# Altium schematic sheet Sheet_1.schdoc
size 424 x 281 mm
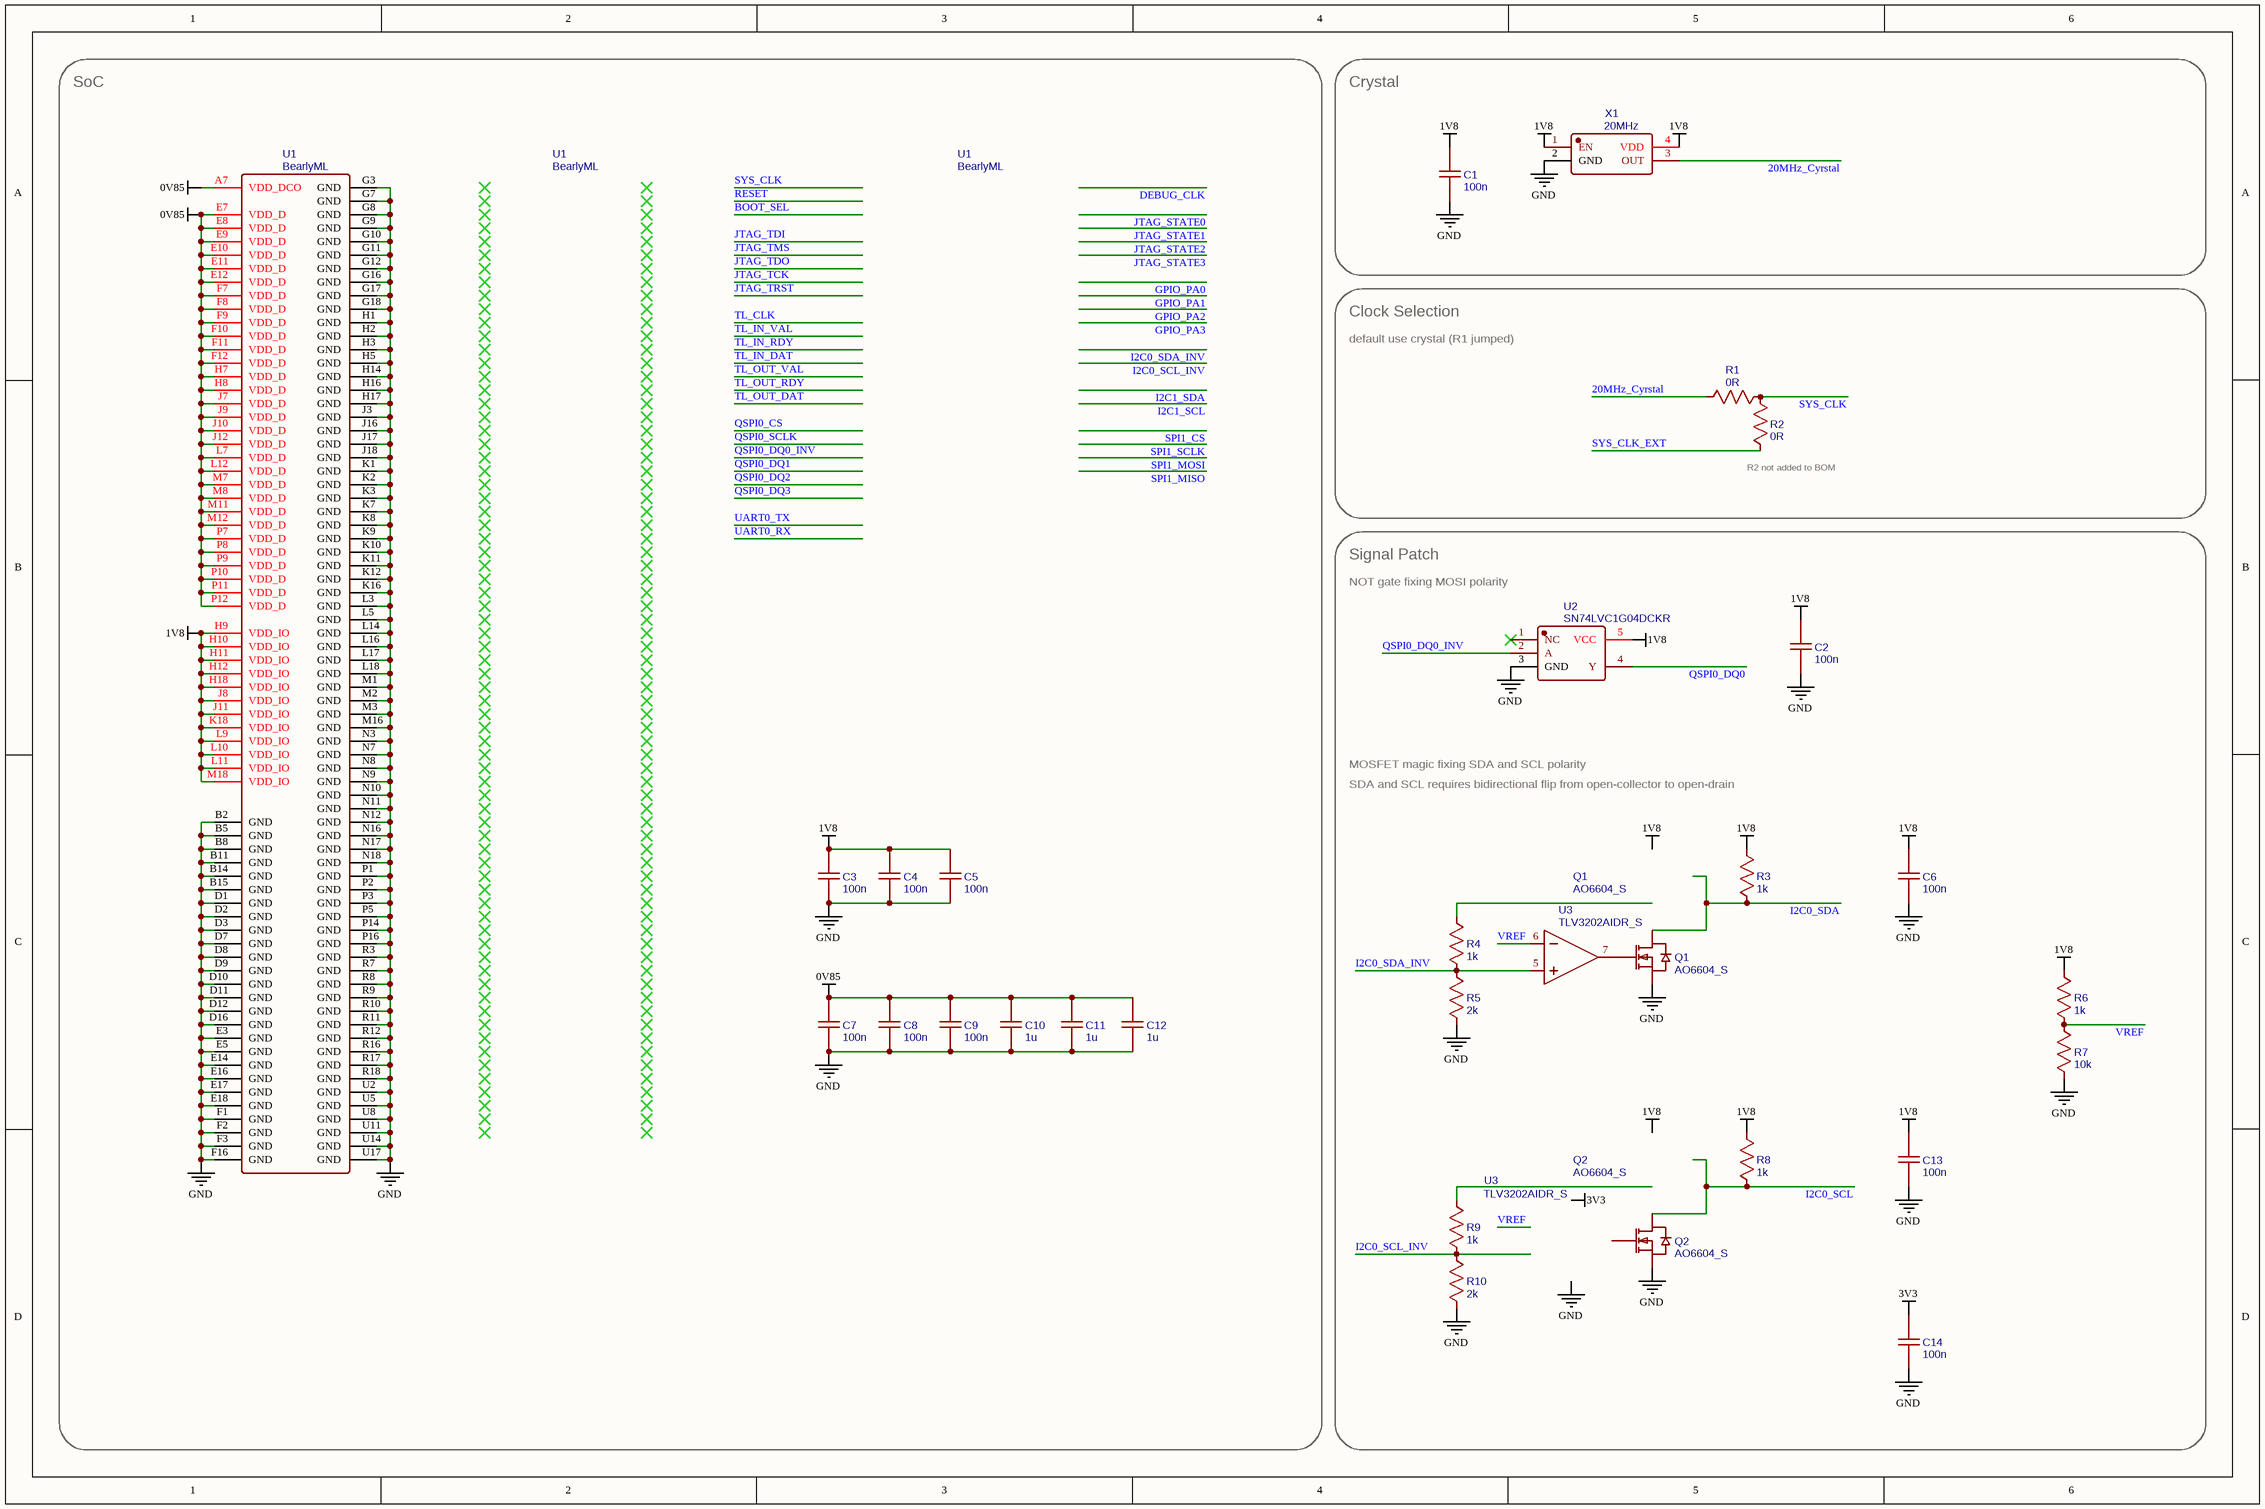
[diagram p0: Sheet_1.schdoc]

## Parts
(Parts that share a designator on the sheet are numbered #1, #2 ... from top to bottom, then left to right.)
C1  100n  [CAPA-0402]
C2  100n  [CAPA-0402]
C3  100n  [CAPA-0402]
C4  100n  [CAPA-0402]
C5  100n  [CAPA-0402]
C6  100n  [CAPA-0402]
C7  100n  [CAPA-0402]
C8  100n  [CAPA-0402]
C9  100n  [CAPA-0402]
C10  1u  [CAPA-0402]
C11  1u  [CAPA-0402]
C12  1u  [CAPA-0402]
C13  100n  [CAPA-0402]
C14  100n  [CAPA-0402]
Q1#1  AO6604_S  [TSOP-6_L3.0-W1.5-P0.95-LS2.8-BR]
Q1#2  AO6604_S  [TSOP-6_L3.0-W1.5-P0.95-LS2.8-BR]
Q2#1  AO6604_S  [TSOP-6_L3.0-W1.5-P0.95-LS2.8-BR]
Q2#2  AO6604_S  [TSOP-6_L3.0-W1.5-P0.95-LS2.8-BR]
R1  0R  [RES-0603]
R2  0R  [RES-0603]
R3  1k  [RES-0402]
R4  1k  [RES-0402]
R5  2k  [RES-0402]
R6  1k  [RES-0402]
R7  10k  [RES-0402]
R8  1k  [RES-0402]
R9  1k  [RES-0402]
R10  2k  [RES-0402]
U1#1  BearlyML  [FC-PBGA-1.0-324-R18-C18_INTEL]
U1#2  BearlyML  [FC-PBGA-1.0-324-R18-C18_INTEL]
U1#3  BearlyML  [FC-PBGA-1.0-324-R18-C18_INTEL]
U2  SN74LVC1G04DCKR  [SOT-353_L2.1-W1.3-P0.65-LS2.3-BR]
U3#1  TLV3202AIDR_S  [SOIC-8_L5.0-W4.0-P1.27-LS6.0-BL]
U3#2  TLV3202AIDR_S  [SOIC-8_L5.0-W4.0-P1.27-LS6.0-BL]
X1  20MHz  [OSC-SMD_4P-L2.5-W2.0-BL]

## Blocks framed on the sheet
SoC: C3-C5 C7-C12 U1#1-U1#3
Crystal: C1 X1
Clock Selection: R1 R2
Signal Patch: C2 C6 C13 C14 Q1#1 Q1#2 Q2#1 Q2#2 R3-R10 U2 U3#1 U3#2

## Nets
0V85: C7.2 C8.2 C9.2 C10.2 C11.2 C12.2 U1#1.A7(VDD_DCO) U1#1.E7(VDD_D) U1#1.E8(VDD_D) U1#1.E9(VDD_D) U1#1.E10(VDD_D) U1#1.E11(VDD_D) U1#1.E12(VDD_D) U1#1.F7(VDD_D) U1#1.F8(VDD_D) U1#1.F9(VDD_D) U1#1.F10(VDD_D) U1#1.F11(VDD_D) U1#1.F12(VDD_D) U1#1.H7(VDD_D) U1#1.H8(VDD_D) U1#1.J7(VDD_D) U1#1.J9(VDD_D) U1#1.J10(VDD_D) U1#1.J12(VDD_D) U1#1.L7(VDD_D) U1#1.L12(VDD_D) U1#1.M7(VDD_D) U1#1.M8(VDD_D) U1#1.M11(VDD_D) U1#1.M12(VDD_D) U1#1.P7(VDD_D) U1#1.P8(VDD_D) U1#1.P9(VDD_D) U1#1.P10(VDD_D) U1#1.P11(VDD_D) U1#1.P12(VDD_D)
1V8: C1.2 C2.2 C3.2 C4.2 C5.2 C6.2 C13.2 R3.2 R6.2 R8.2 U1#1.H9(VDD_IO) U1#1.H10(VDD_IO) U1#1.H11(VDD_IO) U1#1.H12(VDD_IO) U1#1.H18(VDD_IO) U1#1.J8(VDD_IO) U1#1.J11(VDD_IO) U1#1.K18(VDD_IO) U1#1.L9(VDD_IO) U1#1.L10(VDD_IO) U1#1.L11(VDD_IO) U1#1.M18(VDD_IO) U2.5(VCC) X1.1(EN) X1.4(VDD)
3V3: C14.2
GND: C1.1 C2.1 C3.1 C4.1 C5.1 C6.1 C7.1 C8.1 C9.1 C10.1 C11.1 C12.1 C13.1 C14.1 Q1#2.5(S1) Q2#2.5(S1) R5.1 R7.1 R10.1 U1#1.B2(GND) U1#1.B5(GND) U1#1.B8(GND) U1#1.B11(GND) U1#1.B14(GND) U1#1.B15(GND) U1#1.D1(GND) U1#1.D2(GND) U1#1.D3(GND) U1#1.D7(GND) U1#1.D8(GND) U1#1.D9(GND) U1#1.D10(GND) U1#1.D11(GND) U1#1.D12(GND) U1#1.D16(GND) U1#1.E3(GND) U1#1.E5(GND) U1#1.E14(GND) U1#1.E16(GND) U1#1.E17(GND) U1#1.E18(GND) U1#1.F1(GND) U1#1.F2(GND) U1#1.F3(GND) U1#1.F16(GND) U1#1.G3(GND) U1#1.G7(GND) U1#1.G8(GND) U1#1.G9(GND) U1#1.G10(GND) U1#1.G11(GND) U1#1.G12(GND) U1#1.G16(GND) U1#1.G17(GND) U1#1.G18(GND) U1#1.H1(GND) U1#1.H2(GND) U1#1.H3(GND) U1#1.H5(GND) U1#1.H14(GND) U1#1.H16(GND) U1#1.H17(GND) U1#1.J3(GND) U1#1.J16(GND) U1#1.J17(GND) U1#1.J18(GND) U1#1.K1(GND) U1#1.K2(GND) U1#1.K3(GND) U1#1.K7(GND) U1#1.K8(GND) U1#1.K9(GND) U1#1.K10(GND) U1#1.K11(GND) U1#1.K12(GND) U1#1.K16(GND) U1#1.L3(GND) U1#1.L5(GND) U1#1.L14(GND) U1#1.L16(GND) U1#1.L17(GND) U1#1.L18(GND) U1#1.M1(GND) U1#1.M2(GND) U1#1.M3(GND) U1#1.M16(GND) U1#1.N3(GND) U1#1.N7(GND) U1#1.N8(GND) U1#1.N9(GND) U1#1.N10(GND) U1#1.N11(GND) U1#1.N12(GND) U1#1.N16(GND) U1#1.N17(GND) U1#1.N18(GND) U1#1.P1(GND) U1#1.P2(GND) U1#1.P3(GND) U1#1.P5(GND) U1#1.P14(GND) U1#1.P16(GND) U1#1.R3(GND) U1#1.R7(GND) U1#1.R8(GND) U1#1.R9(GND) U1#1.R10(GND) U1#1.R11(GND) U1#1.R12(GND) U1#1.R16(GND) U1#1.R17(GND) U1#1.R18(GND) U1#1.U2(GND) U1#1.U5(GND) U1#1.U8(GND) U1#1.U11(GND) U1#1.U14(GND) U1#1.U17(GND) U2.3(GND) X1.2(GND)
20MHz_Cyrstal: R1.2 X1.3(OUT)
I2C0_SCL: Q2#2.6(D1) R8.1
I2C0_SCL_INV: R9.1 R10.2
I2C0_SDA: Q1#2.6(D1) R3.1
I2C0_SDA_INV: R4.1 R5.2 U3#1.5(+IN_B)
QSPI0_DQ0: U2.4(Y)
QSPI0_DQ0_INV: U2.2(A)
SYS_CLK: R1.1 R2.1
SYS_CLK_EXT: R2.2
VREF: R6.1 R7.2 U3#1.6(-IN_B)
NetQ1#2_1: Q1#2.1(G1) U3#1.7(OUT_B)

Not connected (* = marked no-connect by the designer): Q2#2 1(G1); R4 2; R9 2; U2 1(NC)*

## Notes on the sheet
- default use crystal (R1 jumped)
- (near R2) R2 not added to BOM
- NOT gate fixing MOSI polarity
- MOSFET magic fixing SDA and SCL polarity
- SDA and SCL requires bidirectional flip from open-collector to open-drain
- Labels drawn without touching a wire or pin: 1V8, 3V3, GND

## Library data of the parts
C1-C9 C13 C14 = 100n: BOM_Manufacturer Part: CL05B104KB54PNC; BOM_Manufacturer: SAMSUNG; nameAlias: Value(F); BOM_Supplier Part: C307331; BOM_Supplier: LCSC; link: https://atta.szlcsc.com//upload/public/pdf/source/20160103/1457707735223.pdf; spicePre: C; spiceSymbolName: CAPA-0402_100n
C10-C12 = 1u: BOM_Manufacturer Part: CL05A105KA5NQNC; BOM_Manufacturer: SAMSUNG; nameAlias: Value(F); BOM_Supplier Part: C52923; BOM_Supplier: LCSC; link: https://atta.szlcsc.com//upload/public/pdf/source/20160103/1457707735223.pdf; spicePre: C; spiceSymbolName: CAPA-0402_1u
Q1#1 Q2#1 = AO6604_S: BOM_Manufacturer: Alpha&Omega Semiconductor; BOM_Manufacturer Part: AO6604-VB; subpart_no: 2; BOM_Supplier: LCSC; BOM_Supplier Part: C709896; BOM_JLCPCB Part Class: Extended Part; link: http://www.aosmd.com/pdfs/datasheet/AO6604.pdf; spicePre: Q; spiceSymbolName: AO6604_S
Q1#2 Q2#2 = AO6604_S: BOM_Manufacturer: Alpha&Omega Semiconductor; BOM_Manufacturer Part: AO6604-VB; subpart_no: 1; BOM_Supplier: LCSC; BOM_Supplier Part: C709896; BOM_JLCPCB Part Class: Extended Part; link: http://www.aosmd.com/pdfs/datasheet/AO6604.pdf; spicePre: Q; spiceSymbolName: AO6604_S
R1 R2 = 0R: BOM_Manufacturer Part: 0603WAF0000T5E; BOM_Manufacturer: UniOhm 台湾厚声; nameAlias: Value(Ω); BOM_Supplier Part: C21189; BOM_Supplier: LCSC; link: https://atta.szlcsc.com/upload/public/pdf/source/20200306/C422600_1E6D84923E4A46A82E41ADD87F860B5C.pdf; spicePre: R; spiceSymbolName: RES-0603_0R
R3 R4 R6 R8 R9 = 1k: BOM_Manufacturer Part: 0402WGF1001TCE; BOM_Manufacturer: UniOhm 台湾厚声; nameAlias: Value(Ω); BOM_Supplier Part: C11702; BOM_Supplier: LCSC; link: https://atta.szlcsc.com//upload/public/pdf/source/20200306/C422600_1E6D84923E4A46A82E41ADD87F860B5C.pdf; spicePre: R; spiceSymbolName: RES-0402_1k
R5 R10 = 2k: BOM_Manufacturer Part: 0402WGF2001TCE; BOM_Manufacturer: UniOhm 台湾厚声; nameAlias: Value(Ω); BOM_Supplier Part: C4109; BOM_Supplier: LCSC; link: https://atta.szlcsc.com//upload/public/pdf/source/20200306/C422600_1E6D84923E4A46A82E41ADD87F860B5C.pdf; spicePre: R; spiceSymbolName: RES-0402_2k
R7 = 10k: BOM_Manufacturer Part: 0402WGF1002TCE; BOM_Manufacturer: UniOhm 台湾厚声; nameAlias: Value(Ω); BOM_Supplier Part: C25744; BOM_Supplier: LCSC; link: https://atta.szlcsc.com//upload/public/pdf/source/20200306/C422600_1E6D84923E4A46A82E41ADD87F860B5C.pdf; spicePre: R; spiceSymbolName: RES-0402_10k
U1#1 = BearlyML: subpart_no: 1; Contributor: T-K-233; spicePre: U; spiceSymbolName: BearlyML
U1#2 = BearlyML: subpart_no: 3; Contributor: T-K-233; spicePre: U; spiceSymbolName: BearlyML
U1#3 = BearlyML: subpart_no: 2; Contributor: T-K-233; spicePre: U; spiceSymbolName: BearlyML
U2 = SN74LVC1G04DCKR: BOM_Manufacturer: TI; spicePre: X; BOM_Supplier: LCSC; BOM_Manufacturer Part: SN74LVC1G04DCKR; BOM_Supplier Part: C8207; BOM_JLCPCB Part Class: Extended Part; link: https://www.ti.com/lit/ds/symlink/sn74lvc1g04.pdf; spiceSymbolName: SN74LVC1G04DCKR
U3#1 = TLV3202AIDR_S: BOM_Manufacturer: TI; subpart_no: 1; BOM_Supplier Part: C129325; BOM_Supplier: LCSC; BOM_Manufacturer Part: TLV3202AIDR; Operating Temperature: -40°C ~ 125°C; BOM_JLCPCB Part Class: Extended Part; spicePre: U; spiceSymbolName: TLV3202AIDR_S
U3#2 = TLV3202AIDR_S: BOM_Manufacturer: TI; subpart_no: 2; BOM_Supplier Part: C129325; BOM_Supplier: LCSC; BOM_Manufacturer Part: TLV3202AIDR; Operating Temperature: -40°C ~ 125°C; BOM_JLCPCB Part Class: Extended Part; spicePre: U; spiceSymbolName: TLV3202AIDR_S
X1 = 20MHz: BOM_Manufacturer: YXC 扬兴晶振; BOM_Manufacturer Part: OT252020MJBA4SL; nameAlias: Frequency; BOM_Supplier: LCSC; BOM_Supplier Part: C669067; BOM_JLCPCB Part Class: Extended Part; spicePre: X; spiceSymbolName: OT252020MJBA4SL